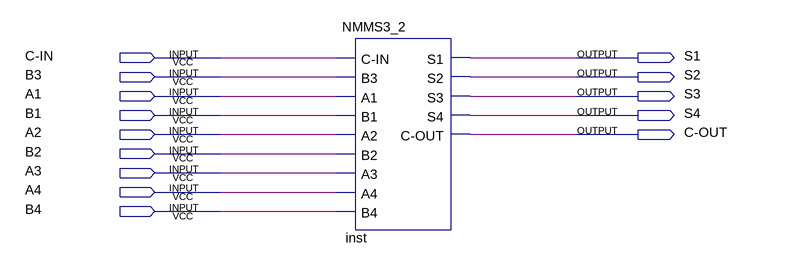
[diagram p0: schematic sheet]
// Quartus schematic NMMS3_2DG.bdf as structural Verilog: 1 symbols, 14 pins
module NMMS3_2DG (
  input  \C-IN ,
  input  B3,
  input  A1,
  input  B1,
  input  A2,
  input  B2,
  input  A3,
  input  A4,
  input  B4,
  output S1,
  output S2,
  output S3,
  output S4,
  output \C-OUT 
);

  NMMS3_2 inst (
    .\C-IN (\C-IN ), .B3(B3), .A1(A1), .B1(B1), .A2(A2), .B2(B2), .A3(A3), .A4(A4), .B4(B4), .S1(S1),
    .S2(S2), .S3(S3), .S4(S4), .\C-OUT (\C-OUT ));
endmodule
